# Altium schematic sheet Rotary_Pot.SchDoc
size A
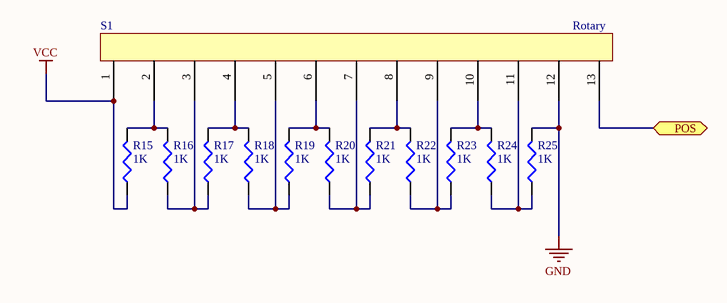
[diagram p0: Rotary_Pot.SchDoc]

## Parts
R15  value 1K  [J1-0603]  (hidden comment: Res3)
R16  value 1K  [J1-0603]  (hidden comment: Res3)
R17  value 1K  [J1-0603]  (hidden comment: Res3)
R18  value 1K  [J1-0603]  (hidden comment: Res3)
R19  value 1K  [J1-0603]  (hidden comment: Res3)
R20  value 1K  [J1-0603]  (hidden comment: Res3)
R21  value 1K  [J1-0603]  (hidden comment: Res3)
R22  value 1K  [J1-0603]  (hidden comment: Res3)
R23  value 1K  [J1-0603]  (hidden comment: Res3)
R24  value 1K  [J1-0603]  (hidden comment: Res3)
R25  value 1K  [J1-0603]  (hidden comment: Res3)
S1  Rotary  [Rotary]

## Ports
POS (bidir)

## Nets
GND: R25.2 S1.12
VCC: R15.1 S1.1
POS: S1.13 ; port POS
NetR15_2: R15.2 R16.2 S1.2
NetR16_1: R16.1 R17.1 S1.3
NetR17_2: R17.2 R18.2 S1.4
NetR18_1: R18.1 R19.1 S1.5
NetR19_2: R19.2 R20.2 S1.6
NetR20_1: R20.1 R21.1 S1.7
NetR21_2: R21.2 R22.2 S1.8
NetR22_1: R22.1 R23.1 S1.9
NetR23_2: R23.2 R24.2 S1.10
NetR24_1: R24.1 R25.1 S1.11

## Library data of the parts
R15-R25 = Res3: Resistor; Published: 8-Jun-2000; LatestRevisionDate: 29-May-2009; LatestRevisionNote: IPC-7351 Footprint Added.; PackageReference: J1-0603; Publisher: Altium Limited; PackageDescription: Chip Resistor